# EAGLE design Inverting_LM741 (EAGLE 8.0.0)
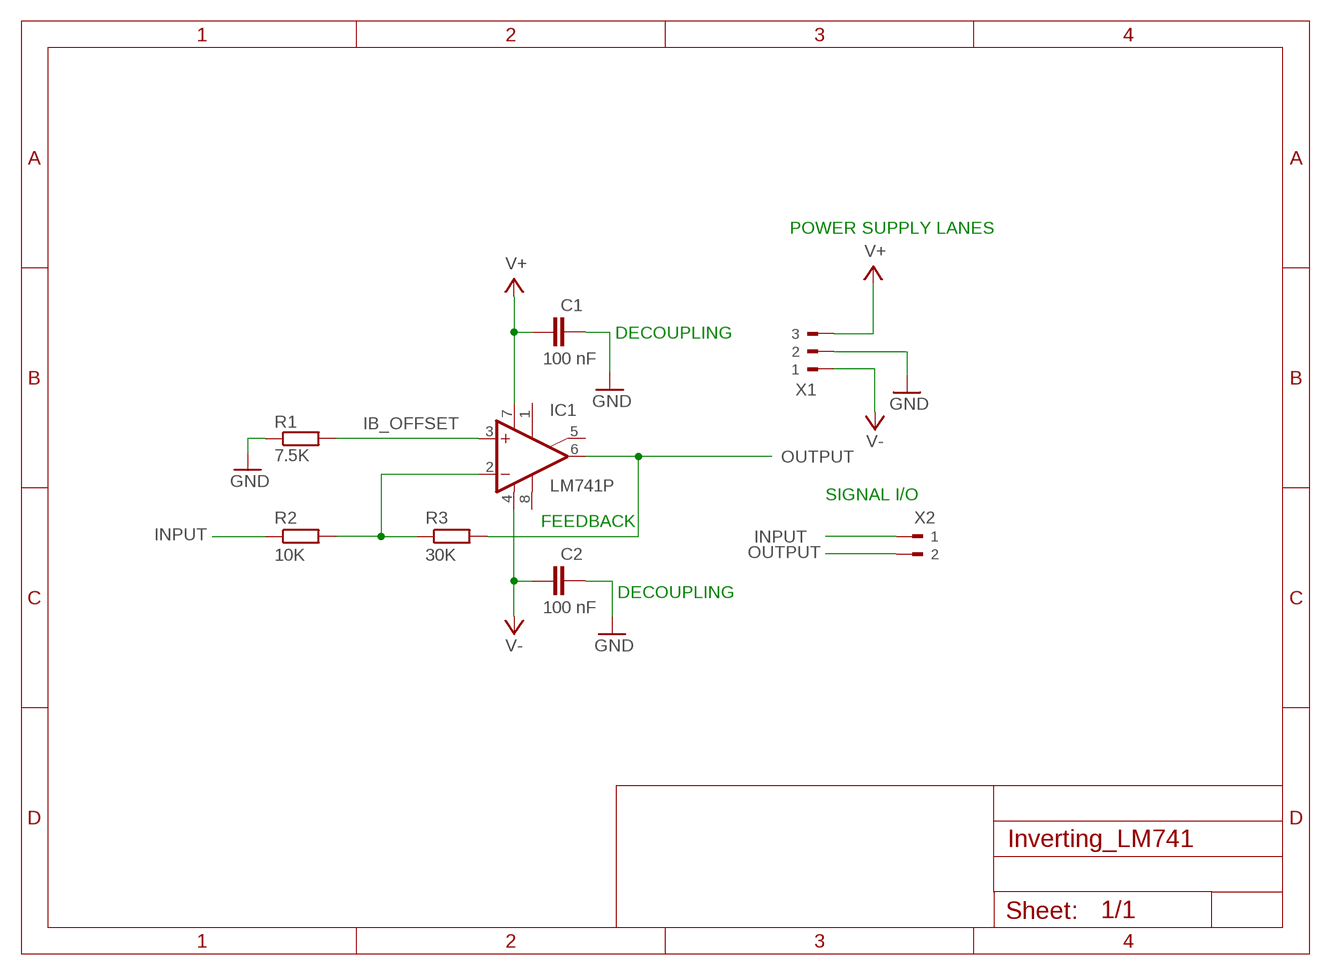
[diagram p0: schematic, sheet 1]

## Parts
C1  100 nF  C-EU025-025X050  [C025-025X050]
C2  100 nF  C-EU025-025X050  [C025-025X050]
IC1  LM741P  [DIL08]
R1  7.5K  R-EU_0207/10  [0207/10]
R2  10K  R-EU_0207/10  [0207/10]
R3  30K  R-EU_0207/10  [0207/10]
X1  90-3  [90-3]
X2  90-2  [90-2]

## Nets
GND: C1.1 C2.1 R1.1 X1.2
IB_OFFSET: IC1.3(+IN) R1.2
INPUT: R2.1 X2.1
OP_AMP_INPUT: IC1.2(-IN) R2.2 R3.1
OUTPUT: IC1.6(OUT) R3.2 X2.2
V+: C1.2 IC1.7(V+) X1.3
V-: C2.2 IC1.4(V-) X1.1
Unconnected: IC1.1(ON1) IC1.5(ON2) IC1.8(OPT)

## Notes on the sheet
- POWER SUPPLY LANES
- DECOUPLING
- SIGNAL I/O
- FEEDBACK
- DECOUPLING

## Library data of the parts
C1 C2 = rcl:C-EU: CAPACITOR, European symbol
IC1 = linear:*741: OP AMP
R1-R3 = rcl:R-EU_: RESISTOR, European symbol
X1 = con-weidmueller-sl35:90-3: WEIDMUELLER CLAMP CONNECTOR; OC_FARNELL: unknown; OC_NEWARK: unknown
X2 = con-weidmueller-sl35:90-2: WEIDMUELLER CLAMP CONNECTOR; OC_FARNELL: unknown; OC_NEWARK: unknown

## Board
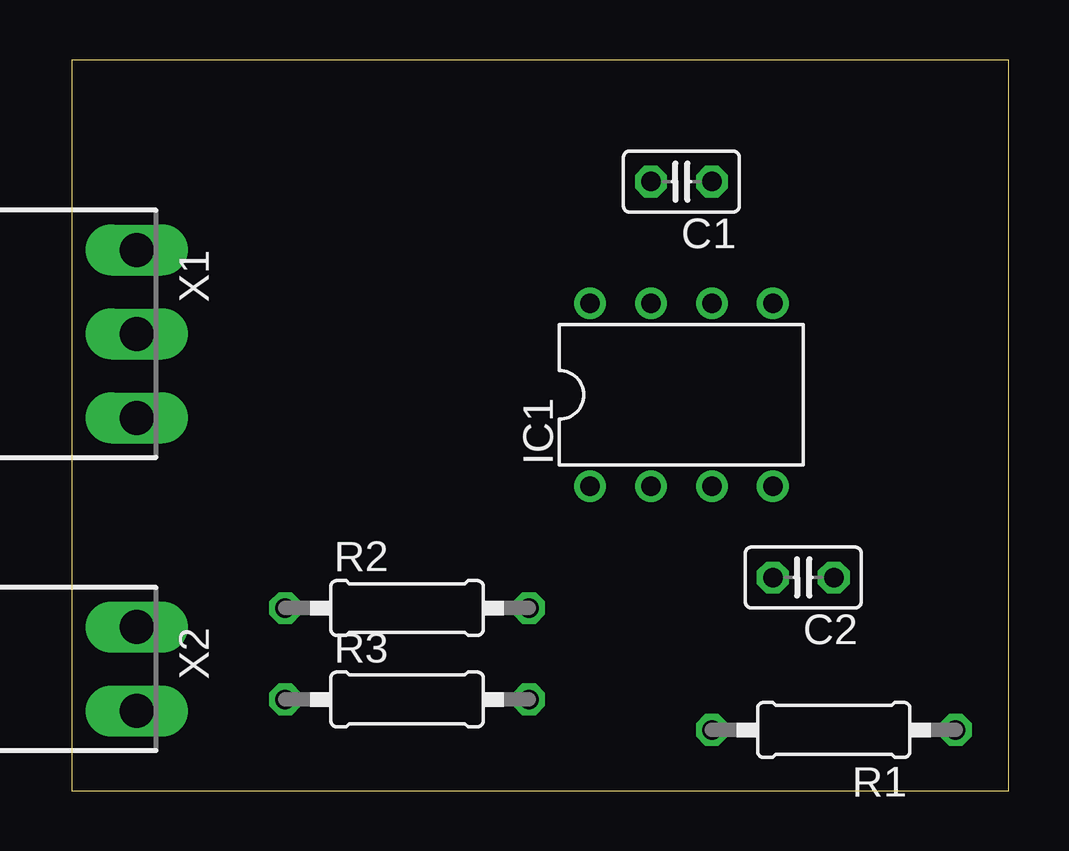
[diagram p1: board, top side]
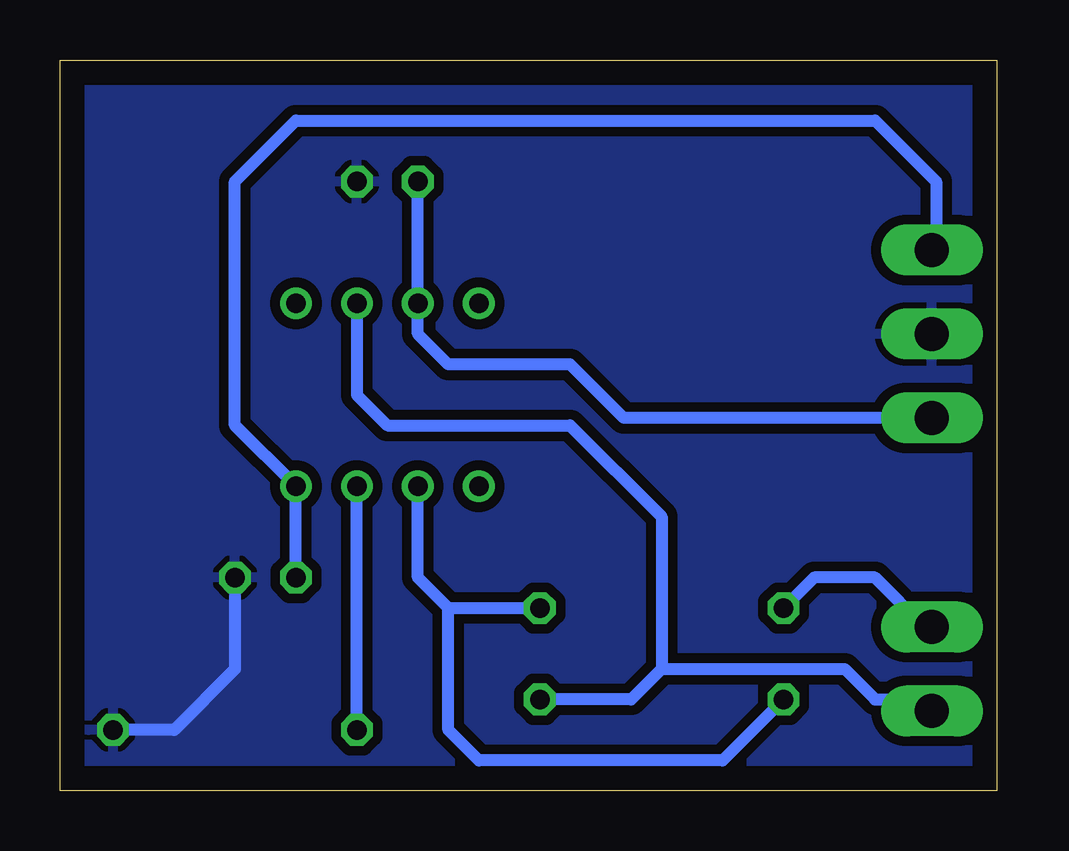
[diagram p2: board, bottom side, seen from below]

Size 39.04 x 30.47 mm. Coordinates in mm from the lower left corner, seen from the top.
Outline: 0,0 39.04,0 39.04,30.47 0,30.47 0,0
Copper layers (1*16): Top 0.035mm / dielectric 1.5mm / Bottom 0.035mm
Design rules "default": minimum track width 10mil, minimum drill 24mil, track to track 8mil, track to pad 8mil, pad to pad 8mil, via to via 8mil, smd to smd 8mil, copper to edge 40mil, drill to drill 8mil, minimum pad ring 10mil, minimum via ring 8mil, stop-mask expansion 4mil, vias tented up to drill 0mil, thermal gap 10mil

### Footprints (pad centres in the part's own frame; a part is rotated, then mirrored left to right if it is on the bottom)
C025-025X050 = drill 0.813 octagon: 1 -1.27,0; 2 1.27,0
DIL08 = drill 0.813 pad 1.27: 1 -3.81,-3.81; 2 -1.27,-3.81; 3 1.27,-3.81; 4 3.81,-3.81; 5 3.81,3.81; 6 1.27,3.81; 7 -1.27,3.81; 8 -3.81,3.81
0207/10 = drill 0.813 octagon: 1 -5.08,0; 2 5.08,0
90-3 = drill 1.422 long: 1 -3.5,5.25; 2 0,5.25; 3 3.5,5.25
90-2 = drill 1.422 long: 1 -1.75,5.25; 2 1.75,5.25

### Placement (x,y rotation side)
C1  25.4,25.4 180 top
C2  30.48,8.89 180 top
IC1  25.4,16.51 0 top
R1  31.75,2.54 180 top
R2  13.97,7.62 0 top
R3  13.97,3.81 0 top
X1  -2.54,19.05 270 top
X2  -2.54,5.08 270 top

### Tracks (layer width: path | path; a pad name or v marks a point on that pad's centre or on a via)
GND
  Bottom 0.508: C2.1 31.75,5.08 34.29,2.54 R1.1
  pour Bottom (isolate 0.406): 0,30.48 38.86,30.48 39.37,29.97 39.37,0 0.51,0 0,0.51
GND_1
  pour Bottom (isolate 0.406): 0,0 10.92,0 11.43,0.51 11.43,5.08 0.51,5.08 0,4.57
IB_OFFSET
  Bottom 0.508: R1.2 IC1.3
INPUT
  Bottom 0.508: X2.1 3.02,6.83 5.08,8.89 7.62,8.89 R2.1
OP_AMP_INPUT
  Bottom 0.508: 22.86,7.62 R2.2 | 22.86,7.62 24.13,8.89 IC1.2 | R3.1 11.43,1.27 21.59,1.27 22.86,2.54 22.86,7.62
OUTPUT
  Bottom 0.508: IC1.6 26.67,16.51 25.4,15.24 17.78,15.24 13.97,11.43 13.97,5.08 | 13.97,5.08 15.24,3.81 R3.2 | 13.97,5.08 6.35,5.08 5.08,3.81 3.19,3.81 X2.2
V+
  Bottom 0.508: X1.3 15.55,15.55 17.78,17.78 22.86,17.78 24.13,19.05 IC1.7 C1.2
V-
  Bottom 0.508: C2.2 IC1.4 31.75,15.24 31.75,25.4 29.21,27.94 5.08,27.94 2.54,25.4 2.54,22.72 X1.1